# Altium schematic sheet STM32G0_microcontroller.SchDoc: STM32G0 microcontroller
size A4; Date: Not used; ApprovedBy: Not used; CheckedBy: Not used; Author: Not used; CompanyName: STMicroelectronics; DrawnBy: Not used; Engineer: Not used; Organization: Not used; Address1: Not used; Address2: Not used; Address3: Not used; Address4: Not used; DocumentNumber: Not used; Revision: Not used; SheetNumber: 3; SheetTotal: 6; CurrentTime: Not used; CurrentDate: Not used; Time: Not used; DocumentFullPathAndName: Not used; DocumentName: Not used; ModifiedDate: Not used; ImagePath: Not used; ProjectName: Not used; Application_BuildNumber: Not used
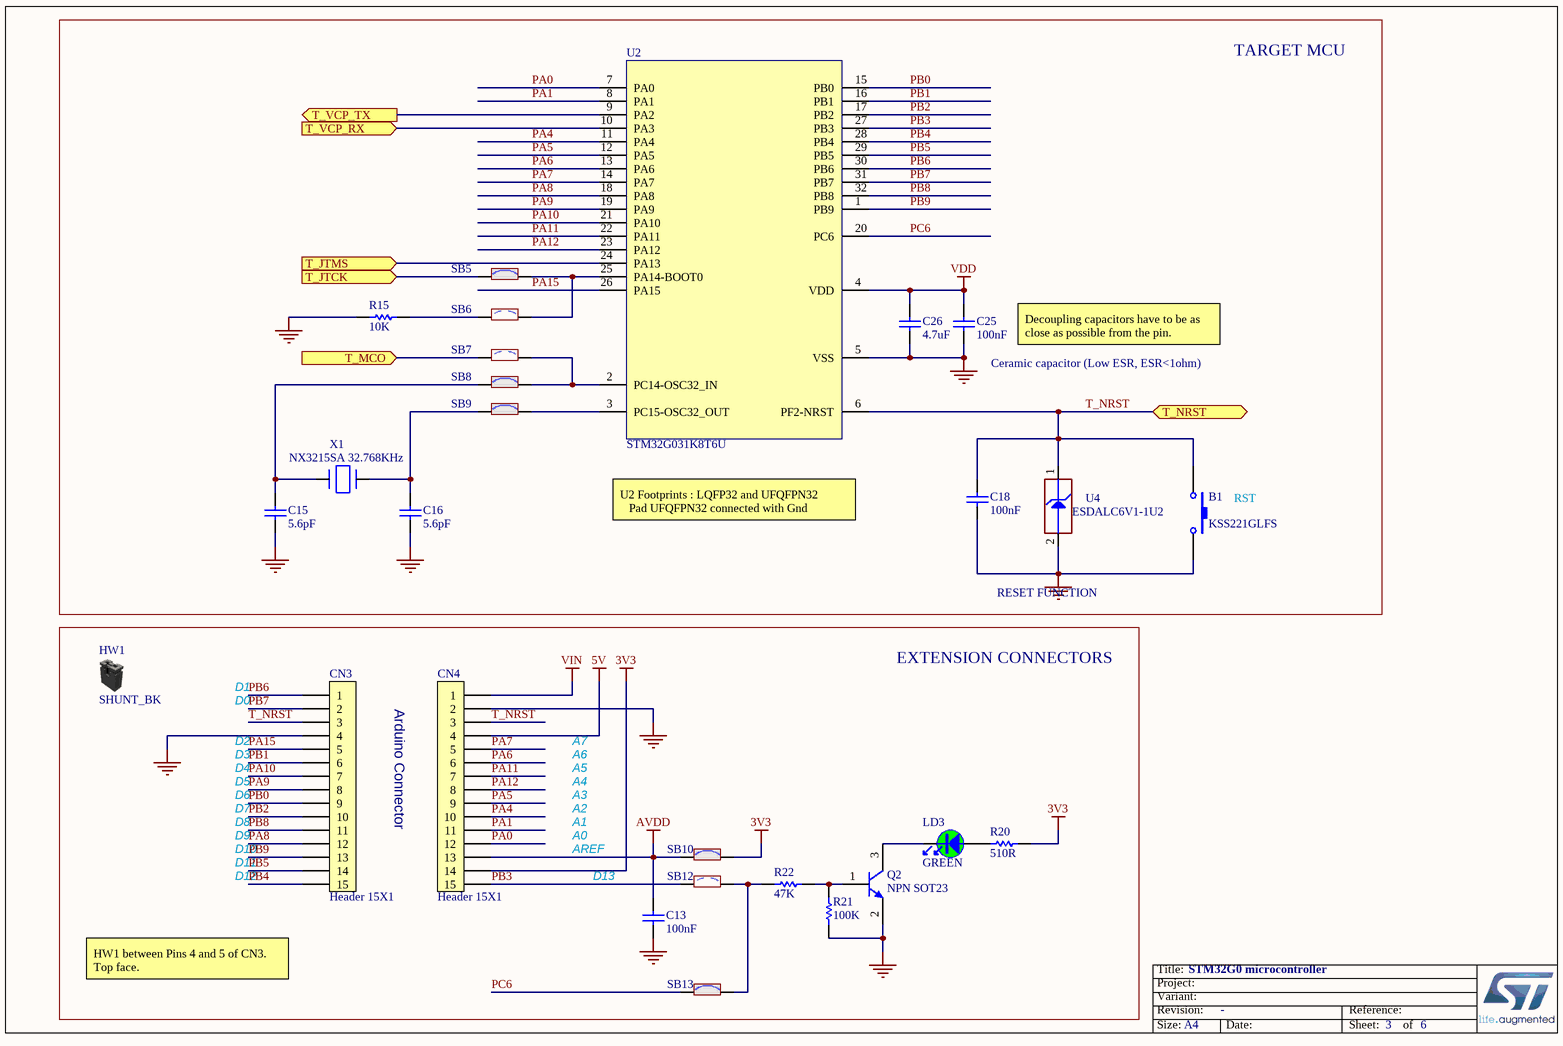
[diagram p0: STM32G0_microcontroller.SchDoc]

## Parts
B1  value KSS221GLFS  [SWI_C&K_ITT_KSS221G]  (hidden comment: SW-PB)
C13  value 100nF  [C0402]  (hidden comment: Capacitor)
C15  value 5.6pF  [C0402]  (hidden comment: Capacitor)
C16  value 5.6pF  [C0402]  (hidden comment: Capacitor)
C18  value 100nF  [C0402]  (hidden comment: Capacitor)
C25  value 100nF  [C0402]  (hidden comment: Capacitor)
C26  value 4.7uF  [C0402]  (hidden comment: Capacitor)
CN3  Header 15x1  [CON_LYCN_313115S161145]
CN4  Header 15x1  [CON_LYCN_313115S161145]
HW1  value SHUNT_BK  (hidden comment: Shunt Black 2.54mm)  (mechanical)
LD3  value GREEN  [LED_0603_GREEN]  (hidden comment: LED_green)
Q2  value NPN SOT23  [NPN_SOT23]  (hidden comment: 9013-SOT23)
R15  value 10K  [R0402]  (hidden comment: Resistor)
R20  value 510R  [R0402]  (hidden comment: Resistor)
R21  value 100K  [R0402]  (hidden comment: Resistor)
R22  value 47K  [R0402]  (hidden comment: Resistor)
SB5  SB_ON  [SOLDER-BRIDGE_R0603-0R]  (value not drawn)
SB6  SB_OFF  [SOLDER-BRIDGE_R0603-0R]  (value not drawn)
SB7  SB_OFF  [SOLDER-BRIDGE_R0603-0R]  (value not drawn)
SB8  SB_ON  [SOLDER-BRIDGE_R0603-0R]  (value not drawn)
SB9  SB_ON  [SOLDER-BRIDGE_R0603-0R]  (value not drawn)
SB10  SB_ON  [SOLDER-BRIDGE_R0603-0R]  (value not drawn)
SB12  SB_OFF  [SOLDER-BRIDGE_R0603-0R]  (value not drawn)
SB13  SB_ON  [SOLDER-BRIDGE_R0603-0R]  (value not drawn)
U2  STM32G031K8T6U  [ICC_LQFP32_7X7_P080__UFQFPN32-EPAD_5X5_P050__DI]
U4  value ESDALC6V1-1U2  [ESD_ST0201]  (hidden comment: ESD-TRANSIL)
X1  value NX3215SA 32.768KHz  [CRY_NX3215SA_2P]  (hidden comment: XTAL_2_PINS)

## Blocks framed on the sheet
TARGET MCU: B1 C15 C16 C18 C25 C26 R15 SB5-SB9 U2 U4 X1
EXTENSION CONNECTORS: C13 CN3 CN4 HW1 LD3 Q2 R20-R22 SB10 SB12 SB13

## Ports
T_JTCK (in), T_JTMS (in), T_MCO (in), T_NRST (bidir), T_VCP_RX (in), T_VCP_TX (out)

## Nets
3V3: CN4.14 R20.2 SB10.2
5V: CN4.4
AVDD: C13.2 CN4.13 SB10.1
GND: B1.2 C13.1 C15.1 C16.1 C18.1 C25.1 C26.1 CN3.4 CN4.2 Q2.2(E) R15.1 R21.1 U2.5(VSS) U4.2(GND)
VDD: C25.2 C26.2 U2.4(VDD)
VIN: CN4.1
PA0: CN4.12 U2.7(PA0)
PA1: CN4.11 U2.8(PA1)
PA4: CN4.10 U2.11(PA4)
PA5: CN4.9 U2.12(PA5)
PA6: CN4.6 U2.13(PA6)
PA7: CN4.5 U2.14(PA7)
PA8: CN3.12 U2.18(PA8)
PA9: CN3.8 U2.19(PA9)
PA10: CN3.7 U2.21(PA10)
PA11: CN4.7 U2.22(PA11)
PA12: CN4.8 U2.23(PA12)
PA15: CN3.5 U2.26(PA15)
PB0: CN3.9 U2.15(PB0)
PB1: CN3.6 U2.16(PB1)
PB2: CN3.10 U2.17(PB2)
PB3: CN4.15 SB12.1 U2.27(PB3)
PB4: CN3.15 U2.28(PB4)
PB5: CN3.14 U2.29(PB5)
PB6: CN3.1 U2.30(PB6)
PB7: CN3.2 U2.31(PB7)
PB8: CN3.11 U2.32(PB8)
PB9: CN3.13 U2.1(PB9)
PC6: SB13.1 U2.20(PC6)
T_JTCK: SB5.1 ; port T_JTCK
T_JTMS: U2.24(PA13) ; port T_JTMS
T_MCO: SB7.1 ; port T_MCO
T_NRST: B1.1 C18.2 CN3.3 CN4.3 U2.6(PF2-NRST) U4.1(IO1) ; port T_NRST
T_VCP_RX: U2.10(PA3) ; port T_VCP_RX
T_VCP_TX: U2.9(PA2) ; port T_VCP_TX
NetC15_2: C15.2 SB8.1 X1.1(X1)
NetC16_2: C16.2 SB9.1 X1.2(X2)
NetLD3_1: LD3.1 R20.1
NetLD3_2: LD3.2 Q2.3(C)
NetQ2_1: Q2.1(B) R21.2 R22.2
NetR15_2: R15.2 SB6.1
NetR22_1: R22.1 SB12.2 SB13.2
NetSB5_2: SB5.2 SB6.2 U2.25(PA14-BOOT0)
NetSB7_2: SB7.2 SB8.2 U2.2(PC14-OSC32_IN)
NetSB9_2: SB9.2 U2.3(PC15-OSC32_OUT)

## Notes on the sheet
- (near C25) Ceramic capacitor (Low ESR, ESR<1ohm)
- Decoupling capacitors have to be as close as possible from the pin.
- U2 Footprints : LQFP32 and UFQFPN32
  Pad UFQFPN32 connected with Gnd
- (near B1) RST
- RESET FUNCTION
- D0
- D1
- Arduino Connector
- D2
- D4
- D3
- D5
- A4
- A5
- A6
- A7
- D6
- D7
- D8
- D9
- D10
- A0
- A1
- A2
- A3
- AREF
- D12
- D11
- D13
- HW1 between Pins 4 and 5 of CN3. Top face.
- Title:
- Project:
- Size:
- Revision:
- Variant:
- -
- Date:
- Reference:
- Sheet:
- of

## Library data of the parts
B1 = MCD-01335: Subminiature Side Actuated Tact Switch for SMT - KSS series - 2.0 Newtons - Gull wing, SPST; Part_Type: Misc; Manufacturer: C&K; Provided_By: SUBCO; ECCN_US: EAR99; ECCN_EU: NEC; Internal_Part_Number: MCD-01335; Status: Checked; Manufacturer_Part_Number: KSS221GLFS; ComponentLink1Description: Datasheet; ComponentLink1URL: http://tunmcdsvn.tun.st.com/Component_Datasheet_Library/Trunk/Misc/C&K_switch_button_KSS221GLFS/C&K_SWITCH_KSS221GLFS.pdf
C13 C18 C25 = MCD-00102: Capacitor, MLCC, 100nF, 16V, X7R, 10%, 0402, T=0,5mm; Manufacturer_Part_Number: CC0402KRX7R7BB104; Manufacturer: YAGEO; Alternate_Manufacturer_Part_Number: GCM155R71C104KA55D; Alternate_Manufacturer: MURATA; Provided_By: SUBCO; ECCN_US: EAR99; ECCN_EU: NEC; Internal_Part_Number: MCD-00102; Status: Released; Package: C0402; ComponentLink1Description: Datasheet; Part_Type: Capacitor; ComponentLink1URL: http://tunmcdsvn.tun.st.com/Component_Datasheet_Library/Trunk/Capacitors/Yageo_Multilayer_Capacitor_X7R_series_100pF_to_22uF
C15 C16 = MCD-01374: Capacitor, MLCC, 5.6pF, 50V, NPO, +/- 0.1pF, 0402, T=0,5mm; Manufacturer_Part_Number: CC0402BRNPO9BN5R6; Manufacturer: YAGEO; Provided_By: SUBCO; Internal_Part_Number: MCD-01374; Status: Released; Part_Type: Capacitor; Package: C0402; ComponentLink1Description: Datasheet; ComponentLink1URL: http://tunmcdsvn.tun.st.com/Component_Datasheet_Library/Trunk/Capacitors/Yageo_Capacitor_NP0_16V-to-50V; ECCN_US: N/A; ECCN_EU: N/A
C26 = MCD-00096: Capacitor, MLCC, 4.7uF, 6V3, X5R, 20%, 0402, T=0,5mm; Manufacturer_Part_Number: GRM155R60J475ME87; Manufacturer: MURATA; Provided_By: SUBCO; ECCN_US: EAR99; ECCN_EU: NEC; Internal_Part_Number: MCD-00096; Status: Obsolete; Part_Type: Capacitor; Package: C0402; ComponentLink1Description: Datasheet; ComponentLink1URL: http://tunmcdsvn.tun.st.com/Component_Datasheet_Library/Trunk/Capacitors/Murata_Capacitor_GR_series
CN3 CN4 = MCD-01332: Pin header, 15x1, 2,54mm, VR, TH, Height 6mm/6mm; Part_Type: Connector; Manufacturer_Part_Number: 313115S161145; Manufacturer: LYCONN; Alternate_Manufacturer_Part_Number: TSW 115-08-F-S; Alternate_Manufacturer: SAMTEC; Provided_By: SUBCO; Internal_Part_Number: MCD-01332; Value: Header 15X1; Status: Footprint available; ComponentLink1Description: Datasheet; ComponentLink1URL: http://tunmcdsvn.tun.st.com/Component_Datasheet_Library/Trunk/Connectors/LYCN_3131xxS141; ECCN_US: n/a; ECCN_EU: n/a
HW1 = MCD-00122: SHUNT, 2.54mm, height 6.10mm, BLACK; Part_Type: Misc; Manufacturer_Part_Number: SNT-100-BK-G; Manufacturer: SAMTEC; Alternate_Manufacturer_Part_Number: MJ-6B2.0*3.5; Alternate_Manufacturer: LIANYI; Provided_By: SUBCO; ECCN_US: EAR99; ECCN_EU: NEC; Internal_Part_Number: MCD-00122; Status: Released; ComponentLink1Description: Datasheet; ComponentLink1URL: http://tunmcdsvn.tun.st.com/Component_Datasheet_Library/Trunk/Connectors/Samtec_Shunt_Jumper_SNT100
LD3 = MCD-00050: LED, Green, 0603; Manufacturer_Part_Number: 19-213SYGC/S530-E2/TR8; Manufacturer: EVERLIGHT; Part_Type: Display; Provided_By: SUBCO; ECCN_US: EAR99; ECCN_EU: NEC; Internal_Part_Number: MCD-00050; ComponentLink1Description: Datasheet; Status: Released; ComponentLink1URL: http://tunmcdsvn.tun.st.com/Component_Datasheet_Library/Trunk/Display/Everlight_SMD-LED-GREEN_19-213SYGC-S530-XX-TR8-v3.doc; Package: LED 0603
Q2 = MCD-00073: NPN Bipolar Transistor; Part_Type: IC; Manufacturer_Part_Number: BSR14; Manufacturer: ON SEMICONDUCTOR; Alternate_Manufacturer_Part_Number: MMBT2222LT1G / MMBT2222ALT1G / MMBT2222ALT3G; Provided_By: SUBCO; ECCN_US: EAR99; ECCN_EU: NEC; Revision: *; Internal_Part_Number: MCD-00073; Status: Released; ComponentLink1Description: Datasheet; ComponentLink1URL: http://tunmcdsvn.tun.st.com/Component_Datasheet_Library/Trunk/IC/NXP_Transistor_BSR14; Alternate_Manufacturer: ON SEMICONDUCTOR; Package: SOT23
R15 = MCD-00053: Resistor,10K,0402,1%,1/16W; Manufacturer_Part_Number: RC0402FR-0710KL; Manufacturer: YAGEO; Provided_By: SUBCO; ECCN_US: EAR99; ECCN_EU: NEC; Internal_Part_Number: MCD-00053; Status: Released; Part_Type: Resistor; Package: R0402; ComponentLink1Description: Datasheet; ComponentLink1URL: http://tunmcdsvn.tun.st.com/Component_Datasheet_Library/Trunk/Resistors/Yageo_Resistor_RC0402-series
R20 = MCD-00064: Resistor,510R,0402,1%,1/16W; Manufacturer_Part_Number: RC0402FR-07510RL; Manufacturer: YAGEO; Provided_By: SUBCO; ECCN_US: EAR99; ECCN_EU: NEC; Internal_Part_Number: MCD-00064; Status: Released; Part_Type: Resistor; Package: R0402; ComponentLink1Description: Datasheet; ComponentLink1URL: http://tunmcdsvn.tun.st.com/Component_Datasheet_Library/Trunk/Resistors/Yageo_Resistor_RC0402-series
R21 = MCD-00059: Resistor,100K,0402,1%,1/16W; Manufacturer_Part_Number: RC0402FR-07100KL; Manufacturer: YAGEO; Alternate_Manufacturer_Part_Number: RT0402FRE07100KL; Provided_By: SUBCO; ECCN_US: EAR99; ECCN_EU: NEC; Internal_Part_Number: MCD-00059; Status: Released; Part_Type: Resistor; Alternate_Manufacturer: YAGEO; Package: R0402; ComponentLink1Description: Datasheet; ComponentLink1URL: http://tunmcdsvn.tun.st.com/Component_Datasheet_Library/Trunk/Resistors/Yageo_Resistor_RC0402-series
R22 = MCD-00063: Resistor,47K,0402,1%,1/16W; Manufacturer_Part_Number: RC0402FR-0747KL; Manufacturer: YAGEO; Provided_By: SUBCO; ECCN_US: EAR99; ECCN_EU: NEC; Internal_Part_Number: MCD-00063; Status: Released; Part_Type: Resistor; Package: R0402; ComponentLink1Description: Datasheet; ComponentLink1URL: http://tunmcdsvn.tun.st.com/Component_Datasheet_Library/Trunk/Resistors/Yageo_Resistor_RC0402-series
SB5 SB8-SB10 SB13 = MCD-00071: Solder Bridge ON; Part_Type: Mechanical; Manufacturer_Part_Number: RC0603JR-070RL; Manufacturer: YAGEO; Provided_By: SUBCO; Internal_Part_Number: MCD-00071; Status: Released; ComponentLink1Description: Datasheet; Package: SB0603; ComponentLink1URL: http://tunmcdsvn.tun.st.com/Component_Datasheet_Library/Trunk/Resistors/Yageo_Resistor_RC0603-series; ECCN_US: n/a; ECCN_EU: n/a
SB6 SB7 SB12 = MCD-00072: Solder Bridge OFF; Part_Type: Mechanical; Manufacturer_Part_Number: RC0603JR-070RL; Manufacturer: YAGEO; Provided_By: SUBCO; Internal_Part_Number: MCD-00072; Status: Released; Package: SB0603; ComponentLink1Description: Datasheet; ComponentLink1URL: http://tunmcdsvn.tun.st.com/Component_Datasheet_Library/Trunk/Resistors/Yageo_Resistor_RC0603-series; ECCN_US: n/a; ECCN_EU: n/a
U2 = MCD-01738: Mainstream Arm Cortex-M0+ MCU with 64 Kbytes of of Flash memory memory, 8 Kbytes RAM, 64 MHz CPU, 2x USART, timers, ADC, comm. I/F, 1.65-3.6V; Manufacturer: STMICROELECTRONICS; Part_Type: IC; Provided_By: SUBCO with ST control; ECCN_US: 3A991A2; ECCN_EU: NEC; Manufacturer_Part_Number: STM32G031K8T6U; Package: LQFP32; Internal_Part_Number: MCD-01738; Value: STM32G031K8T6U; Status: Checked; ComponentLink1Description: Datasheet
U4 = MCD-00170: ESD protection 6V1; Part_Type: Diode; Manufacturer: STMICROELECTRONICS; BMS_Part_Number: 9151132; Provided_By: SUBCO with ST control; ECCN_US: EAR99; ECCN_EU: NEC; Internal_Part_Number: MCD-00170; Status: Released; Manufacturer_Part_Number: ESDALC6V1-1U2; ComponentLink1Description: Datasheet; ComponentLink1URL: http://tunmcdsvn.tun.st.com/Component_Datasheet_Library/Trunk/Diodes/STM_ESD_ESDALC6V1-1U2
X1 = MCD-00091: Crystal 32.768kHz, 6pF, +-20ppm, 50Kohms max, SMD; Part_Type: Crystal_Osc; Manufacturer_Part_Number: NX3215SA 32.768KHz EXS00A-MU00525; Manufacturer: NDK; BMS_Part_Number: 9157034; ECCN_US: EAR99; ECCN_EU: NEC; Provided_By: SUBCO; Internal_Part_Number: MCD-00091; Status: Released; ComponentLink1Description: Datasheet; ComponentLink1URL: http://tunmcdsvn.tun.st.com/Component_Datasheet_Library/Trunk/Crystal_Osc/NDK_Crystal-For-ST_NX3215SA 32.768KHz EXS00A-MU00525 (EXS10B-21238); Order_Code_Digikey: 644-1386